# Altium project BugBuster.PrjPcb (part 4 of 4)

## Sheet IOs.SchDoc
size A2; SheetNumber: 5; SheetTotal: 5
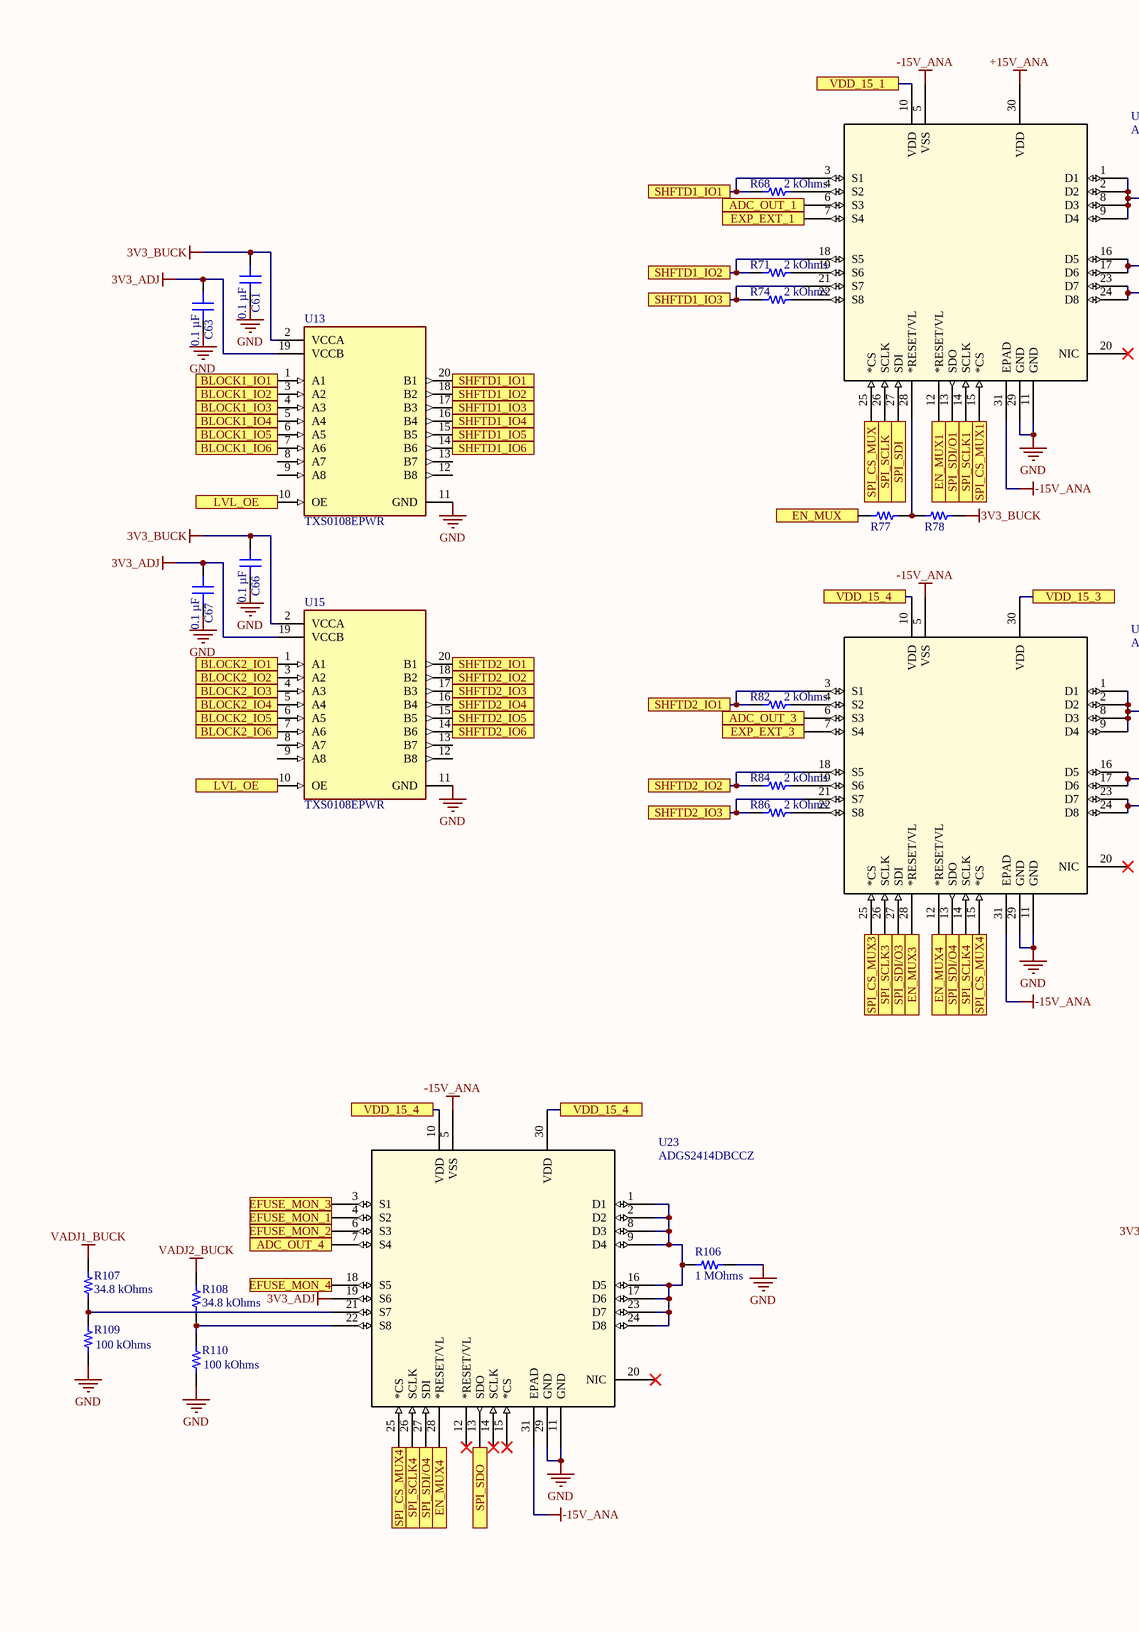
[diagram p4: IOs.SchDoc, left]
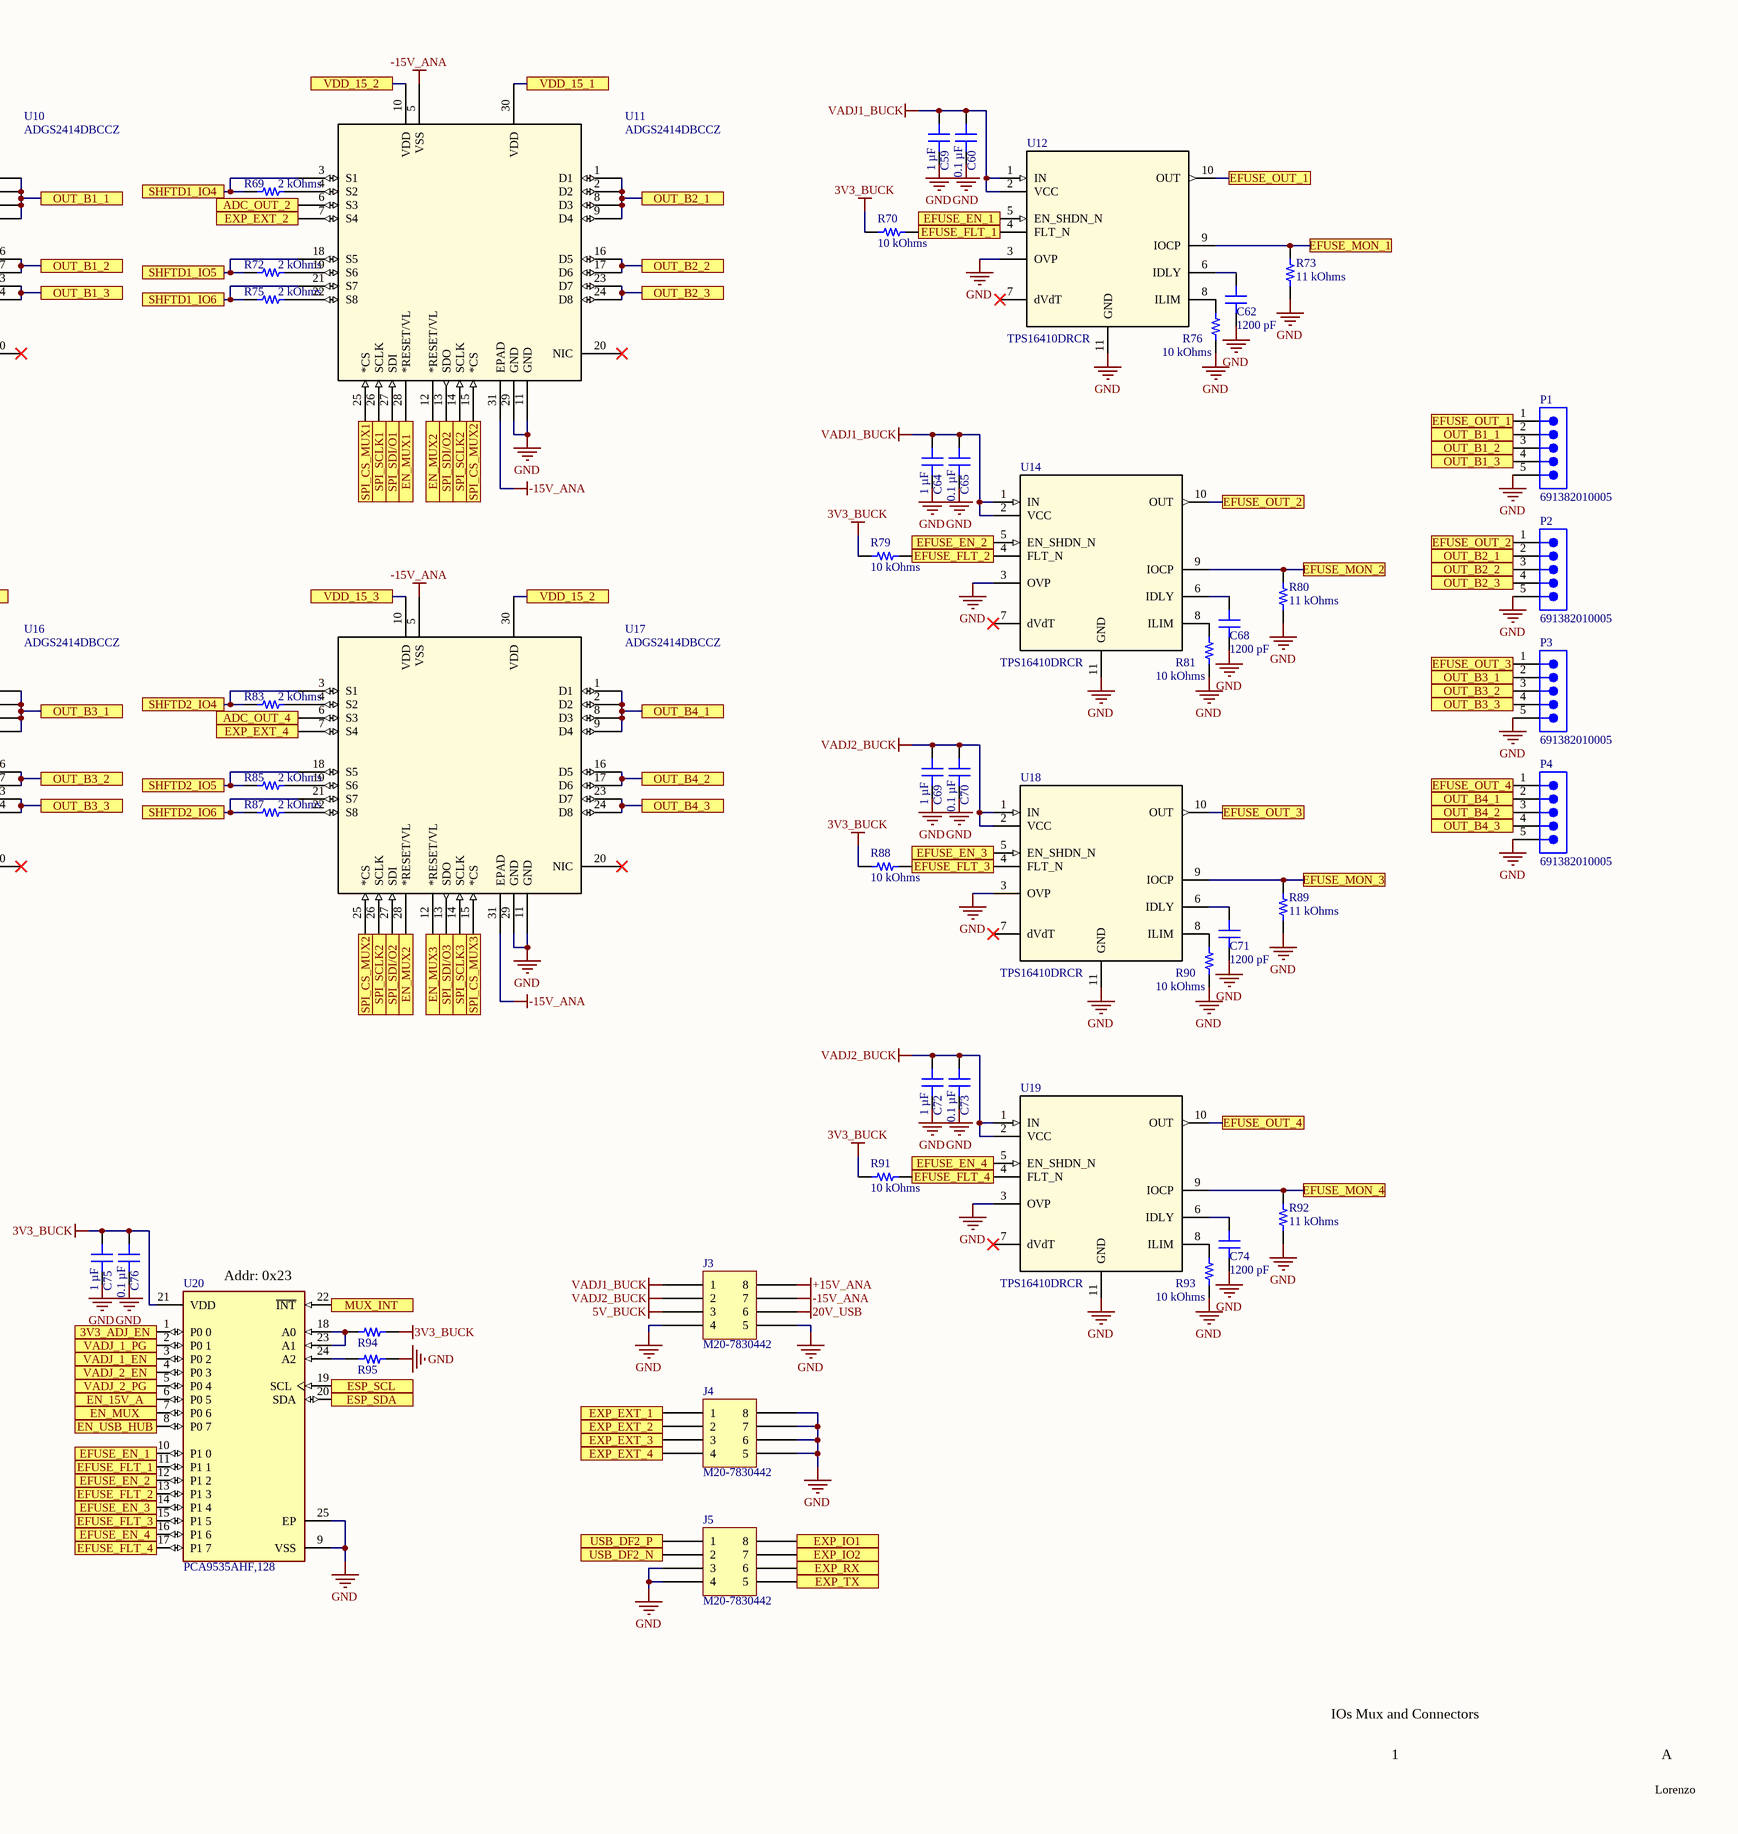
[diagram p5: IOs.SchDoc, right]

### Parts
C59  1 µF  [CAP 0603_1608]
C60  0.1 µF  [CAP 0603_1608]
C61  0.1 µF  [CAP 0603_1608]
C62  1200 pF  [CAP 0603_1608]
C63  0.1 µF  [CAP 0603_1608]
C64  1 µF  [CAP 0603_1608]
C65  0.1 µF  [CAP 0603_1608]
C66  0.1 µF  [CAP 0603_1608]
C67  0.1 µF  [CAP 0603_1608]
C68  1200 pF  [CAP 0603_1608]
C69  1 µF  [CAP 0603_1608]
C70  0.1 µF  [CAP 0603_1608]
C71  1200 pF  [CAP 0603_1608]
C72  1 µF  [CAP 0603_1608]
C73  0.1 µF  [CAP 0603_1608]
C74  1200 pF  [CAP 0603_1608]
C75  1 µF  [CAP 0603_1608]
C76  0.1 µF  [CAP 0603_1608]
J3  M20-7830442  [HARWIN M20-7830445]
J4  M20-7830442  [HARWIN M20-7830445]
J5  M20-7830442  [HARWIN M20-7830445]
P1  691382010005  [691382010005]
P2  691382010005  [691382010005]
P3  691382010005  [691382010005]
P4  691382010005  [691382010005]
R68  2 kOhms  [RES 0603_1608]
R69  2 kOhms  [RES 0603_1608]
R70  10 kOhms  [RES 0603_1608]
R71  2 kOhms  [RES 0603_1608]
R72  2 kOhms  [RES 0603_1608]
R73  11 kOhms  [RES 0603_1608]
R74  2 kOhms  [RES 0603_1608]
R75  2 kOhms  [RES 0603_1608]
R76  10 kOhms  [RES 0603_1608]
R77  (no value)  [RES 0603_1608]
R78  (no value)  [RES 0603_1608]
R79  10 kOhms  [RES 0603_1608]
R80  11 kOhms  [RES 0603_1608]
R81  10 kOhms  [RES 0603_1608]
R82  2 kOhms  [RES 0603_1608]
R83  2 kOhms  [RES 0603_1608]
R84  2 kOhms  [RES 0603_1608]
R85  2 kOhms  [RES 0603_1608]
R86  2 kOhms  [RES 0603_1608]
R87  2 kOhms  [RES 0603_1608]
R88  10 kOhms  [RES 0603_1608]
R89  11 kOhms  [RES 0603_1608]
R90  10 kOhms  [RES 0603_1608]
R91  10 kOhms  [RES 0603_1608]
R92  11 kOhms  [RES 0603_1608]
R93  10 kOhms  [RES 0603_1608]
R94  (no value)  [RES 0603_1608]
R95  (no value)  [RES 0603_1608]
R106  1 MOhms  [RES 0603_1608]
R107  34.8 kOhms  [RES 0603_1608]
R108  34.8 kOhms  [RES 0603_1608]
R109  100 kOhms  [RES 0603_1608]
R110  100 kOhms  [RES 0603_1608]
U10  ADGS2414DBCCZ  [CC-30-3_ADI]
U11  ADGS2414DBCCZ  [CC-30-3_ADI]
U12  TPS16410DRCR  [DRC0010J-IPC_A]
U13  TXS0108EPWR  [FP-PW0020A-IPC_C]
U14  TPS16410DRCR  [DRC0010J-IPC_A]
U15  TXS0108EPWR  [FP-PW0020A-IPC_C]
U16  ADGS2414DBCCZ  [CC-30-3_ADI]
U17  ADGS2414DBCCZ  [CC-30-3_ADI]
U18  TPS16410DRCR  [DRC0010J-IPC_A]
U19  TPS16410DRCR  [DRC0010J-IPC_A]
U20  PCA9535AHF,128  [FP-SOT994-1-MFG]
U23  ADGS2414DBCCZ  [CC-30-3_ADI]

### Ports
3V3_ADJ_EN, ADC_OUT_1, ADC_OUT_2, ADC_OUT_3, ADC_OUT_4, BLOCK1_IO1, BLOCK1_IO2, BLOCK1_IO3, BLOCK1_IO4, BLOCK1_IO5, BLOCK1_IO6, BLOCK2_IO1, BLOCK2_IO2, BLOCK2_IO3, BLOCK2_IO4, BLOCK2_IO5, BLOCK2_IO6, EFUSE_EN_1, EFUSE_EN_2, EFUSE_EN_3, EFUSE_EN_4, EFUSE_FLT_1, EFUSE_FLT_2, EFUSE_FLT_3, EFUSE_FLT_4, EFUSE_MON_1, EFUSE_MON_2, EFUSE_MON_3, EFUSE_MON_4, EFUSE_OUT_1, EFUSE_OUT_2, EFUSE_OUT_3, EFUSE_OUT_4, EN_15V_A, EN_MUX, EN_MUX1, EN_MUX2, EN_MUX3, EN_MUX4, EN_USB_HUB, ESP_SCL, ESP_SDA, EXP_EXT_1, EXP_EXT_2, EXP_EXT_3, EXP_EXT_4, EXP_IO1, EXP_IO2, EXP_RX, EXP_TX, LVL_OE, MUX_INT, OUT_B1_1, OUT_B1_2, OUT_B1_3, OUT_B2_1, OUT_B2_2, OUT_B2_3, OUT_B3_1, OUT_B3_2, OUT_B3_3, OUT_B4_1, OUT_B4_2, OUT_B4_3, SHFTD1_IO1, SHFTD1_IO2, SHFTD1_IO3, SHFTD1_IO4, SHFTD1_IO5, SHFTD1_IO6, SHFTD2_IO1, SHFTD2_IO2, SHFTD2_IO3, SHFTD2_IO4, SHFTD2_IO5, SHFTD2_IO6, SPI_CS_MUX, SPI_CS_MUX1, SPI_CS_MUX2, SPI_CS_MUX3, SPI_CS_MUX4, SPI_SCLK, SPI_SCLK1, SPI_SCLK2, SPI_SCLK3, SPI_SCLK4, SPI_SDI, SPI_SDI/O1, SPI_SDI/O2, SPI_SDI/O3, SPI_SDI/O4, SPI_SDO, USB_DF2_N, USB_DF2_P, VADJ_1_EN, VADJ_1_PG, VADJ_2_EN, VADJ_2_PG, VDD_15_1, VDD_15_2, VDD_15_3, VDD_15_4

### Nets
3V3_ADJ: C63.2 C67.2 U13.19(VCCB) U15.19(VCCB) U23.19(S6)
3V3_BUCK: C61.2 C66.2 C75.2 C76.2 R70.1 R78.1 R79.1 R88.1 R91.1 R94.1 U13.2(VCCA) U15.2(VCCA) U20.21(VDD)
5V_BUCK: J3.3
20V_USB: J3.6
+15V_ANA: J3.8 U10.30(VDD)
-15V_ANA: J3.7 U10.5(VSS) U10.31(EPAD) U11.5(VSS) U11.31(EPAD) U16.5(VSS) U16.31(EPAD) U17.5(VSS) U17.31(EPAD) U23.5(VSS) U23.31(EPAD)
GND: C59.1 C60.1 C61.1 C62.1 C63.1 C64.1 C65.1 C66.1 C67.1 C68.1 C69.1 C70.1 C71.1 C72.1 C73.1 C74.1 C75.1 C76.1 J3.4 J3.5 J4.5 J4.6 J4.7 J4.8 J5.3 J5.4 P1.5 P2.5 P3.5 P4.5 R73.1 R76.1 R80.1 R81.1 R89.1 R90.1 R92.1 R93.1 R95.1 R106.2 R109.1 R110.1 U10.11(GND) U10.29(GND) U11.11(GND) U11.29(GND) U12.3(OVP) U12.11(GND) U13.11(GND) U14.3(OVP) U14.11(GND) U15.11(GND) U16.11(GND) U16.29(GND) U17.11(GND) U17.29(GND) U18.3(OVP) U18.11(GND) U19.3(OVP) U19.11(GND) U20.9(VSS) U20.25(EP) U23.11(GND) U23.29(GND)
VADJ1_BUCK: C59.2 C60.2 C64.2 C65.2 J3.1 R107.2 U12.1(IN) U12.2(VCC) U14.1(IN) U14.2(VCC)
VADJ2_BUCK: C69.2 C70.2 C72.2 C73.2 J3.2 R108.2 U18.1(IN) U18.2(VCC) U19.1(IN) U19.2(VCC)
USB_DF2_N: J5.2 ; port USB_DF2_N
USB_DF2_P: J5.1 ; port USB_DF2_P
NetC62_2: C62.2 U12.6(IDLY)
NetC68_2: C68.2 U14.6(IDLY)
NetC71_2: C71.2 U18.6(IDLY)
NetC74_2: C74.2 U19.6(IDLY)
NetD6_1: U10.6(S3) ; port ADC_OUT_1
NetD7_1: U11.6(S3) ; port ADC_OUT_2
NetD10_1: U16.6(S3) ; port ADC_OUT_3
NetD11_1: U17.6(S3) U23.7(S4) ; port ADC_OUT_4
NetJ4_1: J4.1 U10.7(S4) ; port EXP_EXT_1
NetJ4_2: J4.2 U11.7(S4) ; port EXP_EXT_2
NetJ4_3: J4.3 U16.7(S4) ; port EXP_EXT_3
NetJ4_4: J4.4 U17.7(S4) ; port EXP_EXT_4
NetJ5_5: J5.5 ; port EXP_TX
NetJ5_6: J5.6 ; port EXP_RX
NetJ5_7: J5.7 ; port EXP_IO2
NetJ5_8: J5.8 ; port EXP_IO1
NetP1_1: P1.1 U12.10(OUT) ; port EFUSE_OUT_1
NetP1_2: P1.2 U10.1(D1) U10.2(D2) U10.8(D3) U10.9(D4) ; port OUT_B1_1
NetP1_3: P1.3 U10.16(D5) U10.17(D6) ; port OUT_B1_2
NetP1_4: P1.4 U10.23(D7) U10.24(D8) ; port OUT_B1_3
NetP2_1: P2.1 U14.10(OUT) ; port EFUSE_OUT_2
NetP2_2: P2.2 U11.1(D1) U11.2(D2) U11.8(D3) U11.9(D4) ; port OUT_B2_1
NetP2_3: P2.3 U11.16(D5) U11.17(D6) ; port OUT_B2_2
NetP2_4: P2.4 U11.23(D7) U11.24(D8) ; port OUT_B2_3
NetP3_1: P3.1 U18.10(OUT) ; port EFUSE_OUT_3
NetP3_2: P3.2 U16.1(D1) U16.2(D2) U16.8(D3) U16.9(D4) ; port OUT_B3_1
NetP3_3: P3.3 U16.16(D5) U16.17(D6) ; port OUT_B3_2
NetP3_4: P3.4 U16.23(D7) U16.24(D8) ; port OUT_B3_3
NetP4_1: P4.1 U19.10(OUT) ; port EFUSE_OUT_4
NetP4_2: P4.2 U17.1(D1) U17.2(D2) U17.8(D3) U17.9(D4) ; port OUT_B4_1
NetP4_3: P4.3 U17.16(D5) U17.17(D6) ; port OUT_B4_2
NetP4_4: P4.4 U17.23(D7) U17.24(D8) ; port OUT_B4_3
NetR1_1: U20.20(SDA) ; port ESP_SDA
NetR2_1: U20.19(SCL) ; port ESP_SCL
NetR6_2: U20.22(~{INT}) ; port MUX_INT
NetR15_2: U20.8(P0_7) ; port EN_USB_HUB
NetR19_2: U20.3(P0_2) ; port VADJ_1_EN
NetR26_2: U20.4(P0_3) ; port VADJ_2_EN
NetR31_2: U20.6(P0_5) ; port EN_15V_A
NetR68_1: R68.1 U10.4(S2)
NetR68_2: R68.2 U10.3(S1) U13.20(B1) ; port SHFTD1_IO1
NetR69_1: R69.1 U11.4(S2)
NetR69_2: R69.2 U11.3(S1) U13.16(B4) ; port SHFTD1_IO4
NetR70_2: R70.2 U12.4(FLT_N) U20.11(P1_1) ; port EFUSE_FLT_1
NetR71_1: R71.1 U10.19(S6)
NetR71_2: R71.2 U10.18(S5) U13.18(B2) ; port SHFTD1_IO2
NetR72_1: R72.1 U11.19(S6)
NetR72_2: R72.2 U11.18(S5) U13.15(B5) ; port SHFTD1_IO5
NetR73_2: R73.2 U12.9(IOCP) U23.4(S2) ; port EFUSE_MON_1
NetR74_1: R74.1 U10.22(S8)
NetR74_2: R74.2 U10.21(S7) U13.17(B3) ; port SHFTD1_IO3
NetR75_1: R75.1 U11.22(S8)
NetR75_2: R75.2 U11.21(S7) U13.14(B6) ; port SHFTD1_IO6
NetR76_2: R76.2 U12.8(ILIM)
NetR77_1: R77.1 U20.7(P0_6) ; port EN_MUX
NetR77_2: R77.2 R78.2 U10.28(*RESET/VL)
NetR79_2: R79.2 U14.4(FLT_N) U20.13(P1_3) ; port EFUSE_FLT_2
NetR80_2: R80.2 U14.9(IOCP) U23.6(S3) ; port EFUSE_MON_2
NetR81_2: R81.2 U14.8(ILIM)
NetR82_1: R82.1 U16.4(S2)
NetR82_2: R82.2 U15.20(B1) U16.3(S1) ; port SHFTD2_IO1
NetR83_1: R83.1 U17.4(S2)
NetR83_2: R83.2 U15.16(B4) U17.3(S1) ; port SHFTD2_IO4
NetR84_1: R84.1 U16.19(S6)
NetR84_2: R84.2 U15.18(B2) U16.18(S5) ; port SHFTD2_IO2
NetR85_1: R85.1 U17.19(S6)
NetR85_2: R85.2 U15.15(B5) U17.18(S5) ; port SHFTD2_IO5
NetR86_1: R86.1 U16.22(S8)
NetR86_2: R86.2 U15.17(B3) U16.21(S7) ; port SHFTD2_IO3
NetR87_1: R87.1 U17.22(S8)
NetR87_2: R87.2 U15.14(B6) U17.21(S7) ; port SHFTD2_IO6
NetR88_2: R88.2 U18.4(FLT_N) U20.15(P1_5) ; port EFUSE_FLT_3
NetR89_2: R89.2 U18.9(IOCP) U23.3(S1) ; port EFUSE_MON_3
NetR90_2: R90.2 U18.8(ILIM)
NetR91_2: R91.2 U19.4(FLT_N) U20.17(P1_7) ; port EFUSE_FLT_4
NetR92_2: R92.2 U19.9(IOCP) U23.18(S5) ; port EFUSE_MON_4
NetR93_2: R93.2 U19.8(ILIM)
NetR94_2: R94.2 U20.18(A0) U20.23(A1)
NetR95_2: R95.2 U20.24(A2)
NetR106_1: R106.1 U23.1(D1) U23.2(D2) U23.8(D3) U23.9(D4) U23.16(D5) U23.17(D6) U23.23(D7) U23.24(D8)
NetR107_1: R107.1 R109.2 U23.21(S7)
NetR108_1: R108.1 R110.2 U23.22(S8)
NetU1_4: U13.4(A3) ; port BLOCK1_IO3
NetU1_5: U13.5(A4) ; port BLOCK1_IO4
NetU1_6: U13.6(A5) ; port BLOCK1_IO5
NetU1_7: U13.7(A6) ; port BLOCK1_IO6
NetU1_9: U10.26(SCLK) ; port SPI_SCLK
NetU1_10: U10.27(SDI) ; port SPI_SDI
NetU1_11: U23.13(SDO) ; port SPI_SDO
NetU1_12: U15.7(A6) ; port BLOCK2_IO6
NetU1_17: U15.6(A5) ; port BLOCK2_IO5
NetU1_18: U15.5(A4) ; port BLOCK2_IO4
NetU1_19: U15.4(A3) ; port BLOCK2_IO3
NetU1_20: U15.3(A2) ; port BLOCK2_IO2
NetU1_21: U15.1(A1) ; port BLOCK2_IO1
NetU1_22: U13.10(OE) U15.10(OE) ; port LVL_OE
NetU1_23: U10.25(*CS) ; port SPI_CS_MUX
NetU1_38: U13.3(A2) ; port BLOCK1_IO2
NetU1_39: U13.1(A1) ; port BLOCK1_IO1
NetU4_B1: U20.2(P0_1) ; port VADJ_1_PG
NetU6_B1: U20.5(P0_4) ; port VADJ_2_PG
NetU10_10: U10.10(VDD) U11.30(VDD) ; port VDD_15_1
NetU10_12: U10.12(*RESET/VL) U11.28(*RESET/VL) ; port EN_MUX1
NetU10_13: U10.13(SDO) U11.27(SDI) ; port SPI_SDI/O1
NetU10_14: U10.14(SCLK) U11.26(SCLK) ; port SPI_SCLK1
NetU10_15: U10.15(*CS) U11.25(*CS) ; port SPI_CS_MUX1
NetU11_10: U11.10(VDD) U17.30(VDD) ; port VDD_15_2
NetU11_12: U11.12(*RESET/VL) U17.28(*RESET/VL) ; port EN_MUX2
NetU11_13: U11.13(SDO) U17.27(SDI) ; port SPI_SDI/O2
NetU11_14: U11.14(SCLK) U17.26(SCLK) ; port SPI_SCLK2
NetU11_15: U11.15(*CS) U17.25(*CS) ; port SPI_CS_MUX2
NetU12_5: U12.5(EN_SHDN_N) U20.10(P1_0) ; port EFUSE_EN_1
NetU14_5: U14.5(EN_SHDN_N) U20.12(P1_2) ; port EFUSE_EN_2
NetU16_10: U16.10(VDD) U23.10(VDD) U23.30(VDD) ; port VDD_15_4
NetU16_12: U16.12(*RESET/VL) U23.28(*RESET/VL) ; port EN_MUX4
NetU16_13: U16.13(SDO) U23.27(SDI) ; port SPI_SDI/O4
NetU16_14: U16.14(SCLK) U23.26(SCLK) ; port SPI_SCLK4
NetU16_15: U16.15(*CS) U23.25(*CS) ; port SPI_CS_MUX4
NetU16_25: U16.25(*CS) U17.15(*CS) ; port SPI_CS_MUX3
NetU16_26: U16.26(SCLK) U17.14(SCLK) ; port SPI_SCLK3
NetU16_27: U16.27(SDI) U17.13(SDO) ; port SPI_SDI/O3
NetU16_28: U16.28(*RESET/VL) U17.12(*RESET/VL) ; port EN_MUX3
NetU16_30: U16.30(VDD) U17.10(VDD) ; port VDD_15_3
NetU18_5: U18.5(EN_SHDN_N) U20.14(P1_4) ; port EFUSE_EN_3
NetU19_5: U19.5(EN_SHDN_N) U20.16(P1_6) ; port EFUSE_EN_4
NetU20_1: U20.1(P0_0) ; port 3V3_ADJ_EN

Not connected (* = marked no-connect by the designer): U10 20(NIC)*; U11 20(NIC)*; U12 7(dVdT)*; U13 8(A7) 9(A8) 12(B8) 13(B7); U14 7(dVdT)*; U15 8(A7) 9(A8) 12(B8) 13(B7); U16 20(NIC)*; U17 20(NIC)*; U18 7(dVdT)*; U19 7(dVdT)*; U23 12(*RESET/VL)* 14(SCLK)* 15(*CS)* 20(NIC)*

### Notes on the sheet
- (near U20) Addr: 0x23
- IOs Mux and Connectors
- 1
- Lorenzo
- A

### Library data of the parts
C59 C64 C69 C72 C75 = C1608X5R1H105K080AB: CAP CER 1UF 50V X5R 0603; manufacturer: TDK Corporation; Tolerance: ±10%; Part Number: C1608X5R1H105K080AB; Value: 1 µF; Applications: General Purpose; Capacitance: 1 µF; componentlink1description: Datasheet; componentlink1url: https://product.tdk.com/info/en/catalog/datasheets/mlcc_commercial_general_en.pdf?ref_disty=digikey; componentlink2description: DigiKey Link; componentlink2url: https://www.digikey.com/en/products/detail/tdk-corporation/C1608X5R1H105K080AB/2732903; Device Package: 0603 (1608 Metric); Features: Low ESL; lastupdated: 09/02/2024 20:10:02; Lifecycle Status: Active; Minimum Order: 1; Mounting Type: Surface Mount, MLCC; Operating Temperature: -55°C ~ 85°C; Package / Case: 0603 (1608 Metric); packaging: TapeAndReel; partid: 36337; Part Status: Active; price: 0.02; series: C; Size / Dimension: 0.063" L x 0.031" W (1.60mm x 0.80mm); Supplier 1: DigiKey; Supplier Part Number 1: 445-7468-1-ND; Temperature Coefficient: X5R; Thickness (Max): 0.035" (0.90mm); Voltage - Rated: 50V
C60 C61 C63 C65-C67 C70 C73 C76 = CGA3E2X7R1H104M080AE: CAP CER 0.1UF 50V X7R 0603; manufacturer: TDK Corporation; Tolerance: ±20%; Part Number: CGA3E2X7R1H104M080AE; Value: 0.1 µF; Applications: Automotive, Boardflex Sensitive; Capacitance: 0.1 µF; componentlink1description: Datasheet; componentlink1url: https://product.tdk.com/info/en/catalog/datasheets/mlcc_automotive_soft_en.pdf?ref_disty=digikey; componentlink2description: DigiKey Link; componentlink2url: https://www.digikey.com/en/products/detail/tdk-corporation/CGA3E2X7R1H104M080AE/4490595; Device Package: 0603 (1608 Metric); Features: Soft Termination; lastupdated: 09/02/2024 20:10:15; Lifecycle Status: Active; Minimum Order: 1; Mounting Type: Surface Mount, MLCC; Operating Temperature: -55°C ~ 125°C; Package / Case: 0603 (1608 Metric); packaging: TapeAndReel; partid: 13634; Part Status: Active; price: 0.03; Ratings: AEC-Q200; series: CGA; Size / Dimension: 0.063" L x 0.031" W (1.60mm x 0.80mm); Supplier 1: DigiKey; Supplier Part Number 1: 445-15958-1-ND; Temperature Coefficient: X7R; Thickness (Max): 0.037" (0.95mm); Voltage - Rated: 50V
C62 C68 C71 C74 = C0603S122K5RAC7867: CAP CER 1200PF 50V X7R 0603; manufacturer: KEMET; Tolerance: ±10%; Part Number: C0603S122K5RAC7867; Value: 1200 pF; Applications: General Purpose; Capacitance: 1200 pF; componentlink1description: Datasheet; componentlink1url: https://api.kemet.com/component-edge/download/datasheet/C0603S122K5RACTU.pdf; componentlink2description: DigiKey Link; componentlink2url: https://www.digikey.com/en/products/detail/kemet/C0603S122K5RAC7867/2201830; Device Package: 0603 (1608 Metric); Features: Floating Electrode; lastupdated: 09/02/2024 20:09:56; Lifecycle Status: Active; Minimum Order: 1; Mounting Type: Surface Mount, MLCC; Operating Temperature: -55°C ~ 125°C; Package / Case: 0603 (1608 Metric); packaging: TapeAndReel; partid: 34944; Part Status: Active; price: 0.05; series: SMD Comm X7R FE; Size / Dimension: 0.063" L x 0.031" W (1.60mm x 0.80mm); Supplier 1: DigiKey; Supplier Part Number 1: 399-C0603S122K5RAC7867CT-ND; Temperature Coefficient: X7R; Thickness (Max): 0.034" (0.87mm); Voltage - Rated: 50V
J3-J5 = M20-7830442: CONN RCPT 8POS 0.1 GOLD PCB; Manufacturer: Harwin Inc.; Connector Type: Receptacle; Contact Length - Post: 0.118" (3.00mm); Current Rating (Amps): 3A; Mated Stacking Heights: 11.04mm, 12.63mm; Material Flammability Rating: UL94 V-0; Number of Positions: 8; Number of Positions Loaded: All; Pitch - Mating: 0.100" (2.54mm); Style: Board to Board or Cable; Part Number: M20-7830442; ComponentLink1Description: Datasheet; ComponentLink1URL: https://cdn.harwin.com/pdfs/C001XX_M20_Series_Connectors.pdf; ComponentLink2Description: DigiKey Link; ComponentLink2URL: http://digikey.com/product-detail/en/harwin-inc/M20-7830442/952-1789-ND/3727758; Contact Finish - Mating: Gold; Contact Finish - Post: Tin; Contact Finish Thickness - Mating: Flash; Contact Type: Female Socket; Fastening Type: Push-Pull; Insulation Color: Black; Insulation Height: 0.335" (8.51mm); LastUpdated: 21/09/2022 19:04:26; Lifecycle Status: Active; Minimum Order: 1; Mounting Type: Through Hole; Number of Rows: 2; Operating Temperature: -40°C ~ 105°C; Packaging: Tube; Part Status: Active; Price: 1.36; Row Spacing - Mating: 0.100" (2.54mm); Series: M20; Supplier 1: DigiKey; Supplier Part Number 1: 952-1789-ND; Termination: Solder
P1-P4 = CMP-1502-01746-3: Terminal Block, R/A Header, 5Pos, Th Rohs Compliant: Yes; Number of Positions Per Level: 5; Gender: Male; Pitch: 2.4892mm; Current: 12A; Voltage: 300V; Number of Levels: 1; Lead Pitch: 2.5mm; Packaging: Box; Termination: Solder; Min Operating Temperature: -40°C; Number of Pins: 5; Color: Green; RoHS: Compliant; Number of Positions: 5; Max Operating Temperature: 105°C; Mount: Through Hole; Contact Plating: Tin
R68 R69 R71 R72 R74 R75 R82-R87 = ERJ-S03F2001V: RES SMD 2K OHM 1% 1/10W 0603; Manufacturer: Panasonic Electronic Components; Power (Watts): 0.1W, 1/10W; Temperature Coefficient: ±100ppm/°C; Part Number: ERJ-S03F2001V; Value: 2 kOhms; ComponentLink1Description: Datasheet; ComponentLink1URL: https://industrial.panasonic.com/ww/products/pt/anti-sulfurated-chip-resistors/models/ERJS03F2001V; ComponentLink2Description: DigiKey Link; ComponentLink2URL: https://www.digikey.com/en/products/detail/panasonic-electronic-components/ERJ-S03F2001V/1162048; Composition: Thick Film; Device Package: 0603 (1608 Metric); Features: Anti-Sulfur, Automotive AEC-Q200; Height - Seated (Max): 0.022" (0.55mm); LastUpdated: 09/02/2024 20:40:33; Lifecycle Status: Active; Minimum Order: 1; Number of Terminations: 2; Operating Temperature: -55°C ~ 155°C; Package / Case: 0603 (1608 Metric); Packaging: TapeAndReel; PartId: 82187; Price: 0.02; Ratings: AEC-Q200; Resistance: 2 kOhms; Series: ERJ-S03; Size / Dimension: 0.063" L x 0.031" W (1.60mm x 0.80mm); Supplier 1: DigiKey; Supplier Part Number 1: 10-ERJ-S03F2001VCT-ND; Supplier Device Package: 0603; Tolerance: ±1%
R70 R76 R79 R81 R88 R90 R91 R93 = SG73S1JTTD1002F: RES 10K OHM 1% 1/5W 0603; Manufacturer: KOA Speer Electronics, Inc.; Power (Watts): 0.2W, 1/5W; Temperature Coefficient: ±100ppm/°C; Part Number: SG73S1JTTD1002F; Value: 10 kOhms; ComponentLink1Description: Datasheet; ComponentLink1URL: http://www.koaspeer.com/catimages/Products/SG73S/SG73S.pdf; ComponentLink2Description: DigiKey Link; ComponentLink2URL: https://www.digikey.com/en/products/detail/koa-speer-electronics-inc/SG73S1JTTD1002F/10279969; Composition: Thick Film; Device Package: 0603 (1608 Metric); Features: Automotive AEC-Q200, Moisture Resistant, Pulse Withstanding; Height - Seated (Max): 0.022" (0.55mm); LastUpdated: 09/02/2024 20:43:35; Lifecycle Status: Active; Minimum Order: 1; Number of Terminations: 2; Operating Temperature: -55°C ~ 155°C; Package / Case: 0603 (1608 Metric); Packaging: TapeAndReel; PartId: 5386; Part Status: Active; Price: 0.01; Ratings: AEC-Q200; Resistance: 10 kOhms; Series: SG73S; Size / Dimension: 0.063" L x 0.031" W (1.60mm x 0.80mm); Supplier 1: DigiKey; Supplier Part Number 1: 2019-SG73S1JTTD1002FCT-ND; Supplier Device Package: 0603; Tolerance: ±1%
R73 R80 R89 R92 = CPF0603F11KC1: RES SMD 11K OHM 1% 1/16W 0603; Manufacturer: TE Connectivity Passive Product; Power (Watts): 0.063W, 1/16W; Temperature Coefficient: ±50ppm/°C; Part Number: CPF0603F11KC1; Value: 11 kOhms; ComponentLink1Description: Datasheet; ComponentLink1URL: https://www.te.com/commerce/DocumentDelivery/DDEController?Action=srchrtrv&DocNm=1773200&DocType=DS&DocLang=English; ComponentLink2Description: DigiKey Link; ComponentLink2URL: https://www.digikey.com/en/products/detail/te-connectivity-passive-product/CPF0603F11KC1/2384575; Composition: Thin Film; Device Package: 0603 (1608 Metric); Height - Seated (Max): 0.022" (0.55mm); LastUpdated: 09/02/2024 20:42:52; Lifecycle Status: Active; Minimum Order: 1; Number of Terminations: 2; Operating Temperature: -55°C ~ 155°C; Package / Case: 0603 (1608 Metric); Packaging: TapeAndReel; PartId: 16206; Part Status: Active; Price: 0.02; Resistance: 11 kOhms; Series: CPF, Neohm; Size / Dimension: 0.061" L x 0.031" W (1.55mm x 0.80mm); Supplier 1: DigiKey; Supplier Part Number 1: A102207CT-ND; Supplier Device Package: 0603; Tolerance: ±1%
R77 R78 R94 R95 = MCT0603MZ0000ZP500: RES 0 OHM JUMPER 1/8W 0603; Manufacturer: Vishay Beyschlag; Power (Watts): 0.125W, 1/8W; Part Number: MCT0603MZ0000ZP500; ComponentLink1Description: Datasheet; ComponentLink1URL: http://www.vishay.com/docs/28760/mcat_pro.pdf; ComponentLink2Description: DigiKey Link; ComponentLink2URL: http://digikey.com/product-detail/en/vishay-beyschlag/MCT0603MZ0000ZP500/749-1745-1-ND/7348053; Composition: Thin Film; Device Package: 0603 (1608 Metric); Features: Anti-Sulfur, Automotive AEC-Q200; Height - Seated (Max): 0.022" (0.55mm); LastUpdated: 14/02/2022 15:05:22; Lifecycle Status: Active; Minimum Order: 1; Number of Terminations: 2; Operating Temperature: -55°C ~ 155°C; Package / Case: 0603 (1608 Metric); Packaging: TapeAndReel; PartId: 10258; Part Status: Active; Price: 0.04; Ratings: AEC-Q200; Series: MCT AT - Professional; Size / Dimension: 0.061" L x 0.033" W (1.55mm x 0.85mm); Supplier 1: DigiKey; Supplier Part Number 1: 749-1745-1-ND; Supplier Device Package: 0603; Tolerance: Jumper
R106 = HVC0603T1004FET: RES SMD 1M OHM 1% 1/10W 0603; Manufacturer: Ohmite; Power (Watts): 0.1W, 1/10W; Temperature Coefficient: ±100ppm/°C; Part Number: HVC0603T1004FET; Value: 1 MOhms; ComponentLink1Description: Datasheet; ComponentLink1URL: http://www.ohmite.com/assets/docs/res_hvc.pdf?r=false; ComponentLink2Description: DigiKey Link; ComponentLink2URL: http://digikey.com/product-detail/en/ohmite/HVC0603T1004FET/HVC0603T1004FETCT-ND/4809215; Composition: Thick Film; Device Package: 0603 (1608 Metric); Features: High Voltage; Height - Seated (Max): 0.022" (0.55mm); LastUpdated: 09/02/2024 20:43:28; Lifecycle Status: Active; Minimum Order: 1; Number of Terminations: 2; Operating Temperature: -55°C ~ 155°C; Package / Case: 0603 (1608 Metric); Packaging: TapeAndReel; PartId: 7126; Part Status: Active; Price: 0.83; Resistance: 1 MOhms; Series: HVC; Size / Dimension: 0.059" L x 0.031" W (1.50mm x 0.80mm); Supplier 1: DigiKey; Supplier Part Number 1: HVC0603T1004FETCT-ND; Supplier Device Package: 0603; Tolerance: ±1%
R107 R108 = CRCW060334K8FKEA: RES SMD 34.8K OHM 1% 1/10W 0603; Manufacturer: Vishay Dale; Power (Watts): 0.1W, 1/10W; Temperature Coefficient: ±100ppm/°C; Part Number: CRCW060334K8FKEA; Value: 34.8 kOhms; ComponentLink1Description: Datasheet; ComponentLink1URL: http://www.vishay.com/docs/20035/dcrcwe3.pdf; ComponentLink2Description: DigiKey Link; ComponentLink2URL: https://www.digikey.com/en/products/detail/vishay-dale/CRCW060334K8FKEA/1174842; Composition: Thick Film; Device Package: 0603 (1608 Metric); Features: Automotive AEC-Q200; Height - Seated (Max): 0.020" (0.50mm); LastUpdated: 09/02/2024 20:43:05; Lifecycle Status: Active; Minimum Order: 1; Number of Terminations: 2; Operating Temperature: -55°C ~ 155°C; Package / Case: 0603 (1608 Metric); Packaging: TapeAndReel; PartId: 12662; Part Status: Active; Price: 0.01; Ratings: AEC-Q200; Resistance: 34.8 kOhms; Series: CRCW; Size / Dimension: 0.061" L x 0.033" W (1.55mm x 0.85mm); Supplier 1: DigiKey; Supplier Part Number 1: 541-34.8KHCT-ND; Supplier Device Package: 0603; Tolerance: ±1%
R109 R110 = SG73P1JTTD1003F: RES 100K OHM 1% 1/3W 0603; Manufacturer: KOA Speer Electronics, Inc.; Power (Watts): 0.333W, 1/3W; Temperature Coefficient: ±100ppm/°C; Part Number: SG73P1JTTD1003F; Value: 100 kOhms; ComponentLink1Description: Datasheet; ComponentLink1URL: https://www.koaspeer.com/pdfs/SG73P.pdf; ComponentLink2Description: DigiKey Link; ComponentLink2URL: https://www.digikey.com/en/products/detail/koa-speer-electronics-inc/SG73P1JTTD1003F/10188341; Composition: Thick Film; Device Package: 0603 (1608 Metric); Features: Automotive AEC-Q200, Pulse Withstanding; Height - Seated (Max): 0.022" (0.55mm); LastUpdated: 09/02/2024 20:40:28; Lifecycle Status: Active; Minimum Order: 1; Number of Terminations: 2; Operating Temperature: -55°C ~ 155°C; Package / Case: 0603 (1608 Metric); Packaging: TapeAndReel; PartId: 83707; Price: 0.01; Ratings: AEC-Q200; Resistance: 100 kOhms; Series: SG73P; Size / Dimension: 0.063" L x 0.031" W (1.60mm x 0.80mm); Supplier 1: DigiKey; Supplier Part Number 1: 2019-SG73P1JTTD1003FCT-ND; Supplier Device Package: 0603; Tolerance: ±1%
U10 U11 U16 U17 U23 = ADGS2414DBCCZ: 0.56Omh On Resistance High Density Octal SPST Switch; Manufacturer_Name: Analog Devices Inc; Copyright: Copyright (C) 2025 Ultra Librarian. All rights reserved.; Manufacturer_Part_Number: ADGS2414DBCCZ; RefDes: RefDes; Type: Type
U12 U14 U18 U19 = PTPS16410DRCR: 2.7-V to 40-V, 152-mOmh, 1.8-A eFuse with output power limiting 10-VSON -40 to 125; Manufacturer_Name: Texas Instruments; TYPE: TYPE; RefDes: RefDes; Copyright: Copyright (C) 2026 Ultra Librarian. All rights reserved.; Manufacturer_Part_Number: PTPS16410DRCR
U13 U15 = CMP-2000-04956-2: IC TRNSLTR BIDIRECTIONAL 20TSSOP; Number of Inputs: 8; Supply Current: 8uA; Low Level Output Current: 50mA; Min Supply Voltage: 1.2V; Quiescent Current: 3uA; Output Type: Voltage; Propagation Delay: 4.8ns; Max Supply Voltage: 5.5V; Output Current: 620uA; Turn-On Delay Time: 312ns; Logic Function: Translator; Data Rate: 60Mbps; Rise Time: 6.3ns; High Level Output Current: -50mA; Number of Pins: 20; Packaging: Tape and Reel; Max Operating Temperature: 85°C; Height: 1.15mm; Nominal Supply Current: 8uA; Termination: SMD/SMT; Lead Free: Lead Free; Package Quantity: 1; Number of Bits: 8; Weight: 0.002716oz; Contact Plating: Gold; Series: -; Width: 4.4mm; Radiation Hardening: No; Mount: Surface Mount; Length: 6.5mm; Case/Package: TSSOP; REACH SVHC: No SVHC; RoHS Compliant: Yes; Min Operating Temperature: -40°C; Number of Channels: 8
U20 = CMP-10112-000026-1: IC I/O EXPANDER I2C 24HWQFN; Frequency: 400kHz; Max Frequency: 100kHz; Number of I/Os: 16; Operating Supply Voltage: 5.5V; Power Dissipation: 200mW; Packaging: Tape and Reel; Interface: I2C; Package Quantity: 1; RoHS Compliant: Yes; Number of Pins: 24; Min Operating Temperature: -40°C; Mount: Surface Mount; Contact Plating: Gold; Max Operating Temperature: 85°C; Series: -

## Nets that join several sheets
3V3_ADJ: Power (6 pins), IOs (5 pins)
3V3_BUCK: USB (7 pins), Analog (6 pins), IOs (13 pins)
3V3_LDO: ESP32 (9 pins), Power (7 pins)
5V_BUCK: ESP32 (D1.4 D2.4 D3.4), USB (D5.1), Power (19 pins), Analog (6 pins), IOs (J3.3)
20V_USB: USB (Q1.5-6-7-8), Power (11 pins), IOs (J3.6)
+15V_ANA: Power (6 pins), Analog (10 pins), IOs (J3.8 U10.30)
-15V_ANA: Power (7 pins), Analog (C57.2 C58.2 U9.21 U9.65), IOs (11 pins)
GND: ESP32 (20 pins), USB (35 pins), Power (143 pins), Analog (41 pins), IOs (64 pins)
VADJ1_BUCK: Power (9 pins), IOs (10 pins)
VADJ2_BUCK: Power (9 pins), IOs (10 pins)
NetD6_1: Analog (D6.1 R42.2 R44.2 R47.2), IOs (U10.6)
NetD7_1: Analog (D7.1 R43.2 R45.2 R49.2), IOs (U11.6)
NetD10_1: Analog (D10.1 R54.2 R57.2 R60.2), IOs (U16.6)
NetD11_1: Analog (D11.1 R55.2 R58.2 R62.2), IOs (U17.6 U23.7)
NetJ5_5: ESP32 (U1.37), IOs (J5.5)
NetJ5_6: ESP32 (U1.36), IOs (J5.6)
NetJ5_7: ESP32 (R7.2 U1.24), IOs (J5.7)
NetJ5_8: ESP32 (U1.8), IOs (J5.8)
NetR1_1: ESP32 (R1.1 U1.35), USB (U22.6), Power (U8.1), IOs (U20.20)
NetR2_1: ESP32 (R2.1 U1.34), USB (U22.7), Power (U8.2), IOs (U20.19)
NetR6_2: ESP32 (R6.2 U1.15), IOs (U20.22)
NetR15_2: USB (R15.2 U2.15), IOs (U20.8)
NetR19_2: Power (R19.2 U4.B3), IOs (U20.3)
NetR26_2: Power (R26.2 U6.B3), IOs (U20.4)
NetR31_2: Power (R31.2 U7.B7 U7.K7), IOs (U20.6)
NetR56_2: ESP32 (U1.26), Analog (R56.2 U9.49)
NetR63_2: ESP32 (U1.31), Analog (R63.2 U9.56)
NetR64_2: ESP32 (U1.32), Analog (R64.2 U9.55)
NetR96_1: ESP32 (U1.25), Power (R96.1 U7.D6 U7.H6)
NetU1_4: ESP32 (U1.4), IOs (U13.4)
NetU1_5: ESP32 (U1.5), IOs (U13.5)
NetU1_6: ESP32 (U1.6), IOs (U13.6)
NetU1_7: ESP32 (U1.7), IOs (U13.7)
NetU1_9: ESP32 (U1.9), Analog (U9.51), IOs (U10.26)
NetU1_10: ESP32 (U1.10), Analog (U9.52), IOs (U10.27)
NetU1_11: ESP32 (U1.11), Analog (U9.53), IOs (U23.13)
NetU1_12: ESP32 (U1.12), IOs (U15.7)
NetU1_17: ESP32 (U1.17), IOs (U15.6)
NetU1_18: ESP32 (U1.18), IOs (U15.5)
NetU1_19: ESP32 (U1.19), IOs (U15.4)
NetU1_20: ESP32 (U1.20), IOs (U15.3)
NetU1_21: ESP32 (U1.21), IOs (U15.1)
NetU1_22: ESP32 (U1.22), IOs (U13.10 U15.10)
NetU1_23: ESP32 (U1.23), IOs (U10.25)
NetU1_33: ESP32 (U1.33), Analog (U9.50)
NetU1_38: ESP32 (U1.38), IOs (U13.3)
NetU1_39: ESP32 (U1.39), IOs (U13.1)
NetU4_B1: Power (U4.B1), IOs (U20.2)
NetU6_B1: Power (U6.B1), IOs (U20.5)
USB_DF1_N: ESP32 (U1.13), USB (U2.2)
USB_DF1_P: ESP32 (U1.14), USB (U2.3)
USB_DF2_N: USB (U2.4), IOs (J5.2)
USB_DF2_P: USB (U2.5), IOs (J5.1)